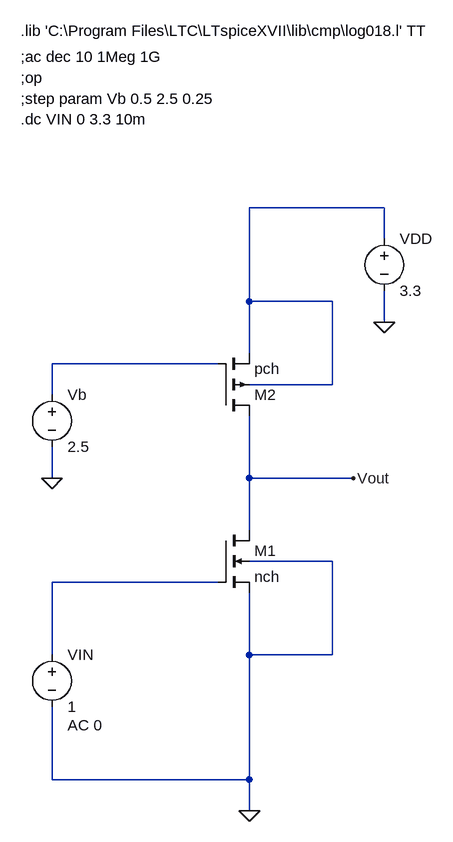
[diagram p0: schematic cs-stage.asc]
cs-stage.asc, the LTspice schematic file:
Version 4
SHEET 1 880 1060
WIRE 416 112 208 112
WIRE 416 160 416 112
WIRE 208 256 208 112
WIRE 336 256 208 256
WIRE 416 288 416 240
WIRE 208 336 208 256
WIRE 160 352 -96 352
WIRE 336 384 336 256
WIRE 336 384 208 384
WIRE -96 400 -96 352
WIRE -96 528 -96 480
WIRE 208 528 208 432
WIRE 368 528 208 528
WIRE 208 608 208 528
WIRE 336 656 208 656
WIRE 160 688 -96 688
WIRE -96 800 -96 688
WIRE 208 800 208 704
WIRE 336 800 336 656
WIRE 336 800 208 800
WIRE -96 992 -96 880
WIRE 208 992 208 800
WIRE 208 992 -96 992
WIRE 208 1040 208 992
FLAG 416 288 0
FLAG 368 528 Vout
FLAG 208 1040 0
FLAG -96 528 0
SYMBOL nmos4 160 608 R0
SYMATTR InstName M1
SYMATTR Value nch
SYMATTR Value2 l=0.18u w=36u
SYMBOL pmos4 160 432 M180
SYMATTR InstName M2
SYMATTR Value pch
SYMATTR Value2 l=0.36u w=18u
SYMBOL voltage 416 144 R0
WINDOW 123 0 0 Left 0
WINDOW 39 0 0 Left 0
SYMATTR InstName VDD
SYMATTR Value 3.3
SYMBOL voltage -96 784 R0
WINDOW 123 24 124 Left 2
WINDOW 39 0 0 Left 0
SYMATTR Value2 AC 0
SYMATTR InstName VIN
SYMATTR Value 1
SYMBOL voltage -96 384 R0
WINDOW 123 0 0 Left 0
WINDOW 39 0 0 Left 0
SYMATTR InstName Vb
SYMATTR Value 2.5
TEXT -144 -160 Left 2 !.lib 'C:\\Program Files\\LTC\\LTspiceXVII\\lib\\cmp\\log018.l' TT
TEXT -144 -120 Left 2 !;ac dec 10 1Meg 1G
TEXT -144 -88 Left 2 !;op
TEXT -144 -24 Left 2 !.dc VIN 0 3.3 10m
TEXT -144 -56 Left 2 !;step param Vb 0.5 2.5 0.25

The netlist it stands for:
* cs-stage.asc
M1 Vout N003 0 0 nch l=0.18u w=36u
M2 Vout N002 N001 N001 pch l=0.36u w=18u
VDD N001 0 3.3
VIN N003 0 1 AC 0
Vb N002 0 2.5
.model NMOS NMOS
.model PMOS PMOS
.lib standard.mos
.lib 'C:\Program Files\LTC\LTspiceXVII\lib\cmp\log018.l' TT
;ac dec 10 1Meg 1G
;op
.dc VIN 0 3.3 10m
;step param Vb 0.5 2.5 0.25
.backanno
.end

* Results of the author's LTspice run, read from the files saved beside the schematic
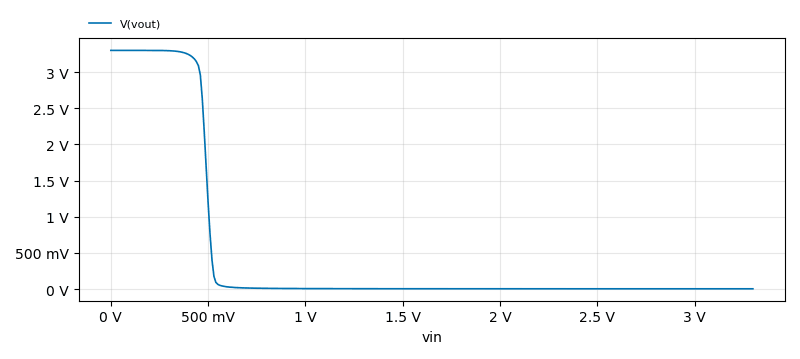
[diagram p1: DC transfer characteristic of cs-stage.asc, plotted from the saved traces]
* DC transfer characteristic, 1 run:
*   V(vout): 3.3 V at vin=0 V, 3.842 mV at vin=3.3 V, min 3.762 mV, max 3.3 V